# EAGLE design mag_encoder_Rev2 (EAGLE 7.4.0)
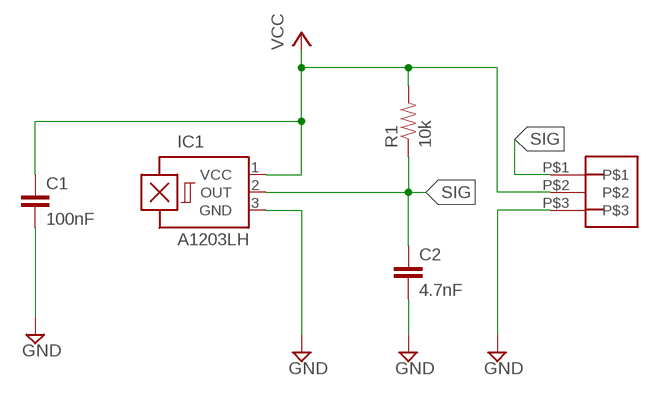
[diagram p0: schematic, sheet 1]

## Parts
C1  100nF  CAP0603-CAP  [0603-CAP]
C2  4.7nF  4.7NF-50V-10%(0603)  [0603-CAP]
IC1  A1203LH  [SOT23-W]
R1  10k  10.5KOHM1/10W1%(0603)  [0603]
U$1  3_PIN_JST-XH  [3_PIN_JST-XH]

## Nets
GND: C1.2 C2.2 IC1.3(GND) U$1.P$3
SIG: C2.1 IC1.2(OUT) R1.1 U$1.P$1
VCC: C1.1 IC1.1(VCC) R1.2 U$1.P$2

## Library data of the parts
C1 = SparkFun-Capacitors:CAP: Capacitor Standard 0603 ceramic capacitor, and 0.1" leaded capacitor.
C2 = SparkFun-Capacitors:4.7NF-50V-10%(0603): CAP-11378; PROD_ID: CAP-11378
IC1 = allegro:A12*?: Hall-effect bipolar switch Source: http://www.allegromicro.com/en/Products/Part_Numbers/1202/1202.pdf; MF: ALLEGRO MICROSYSTEMS, INC.; MPN: A1203LLHLT-T; OC_FARNELL: 1791384; OC_NEWARK: 31K6608
R1 = SparkFun-Resistors:10.5KOHM1/10W1%(0603): RES-09570; PROD_ID: RES-09570; VALUE: 10.5k
U$1 = Clayton:3_PIN_JST-XH: 3-pin JST XH Shrouded Header, top entry, 2.5 mm pitch

## Board
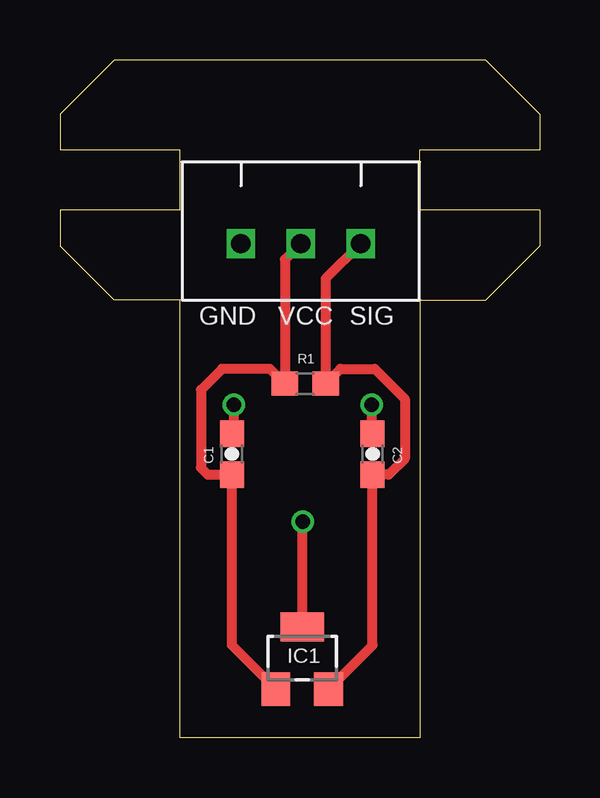
[diagram p1: board, top side]
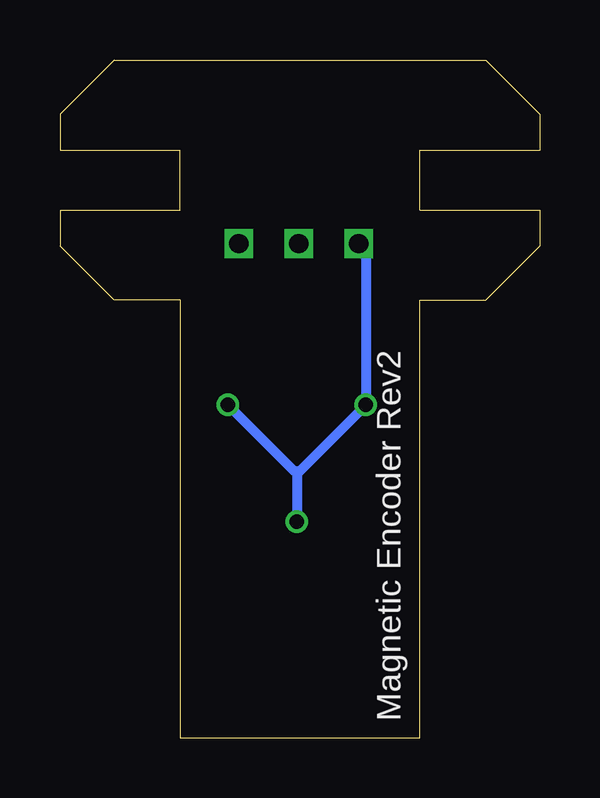
[diagram p2: board, bottom side, seen from below]

Size 20 x 28.25 mm. Coordinates in mm from the lower left corner, seen from the top.
Outline: 5,0 5,18.25 2.25,18.25 0,20.5 0,22 5,22 5,24.5 0,24.5 0,26 2.25,28.25 17.75,28.25 20,26 20,24.5 15,24.5 15,22 20,22 20,20.5 17.75,18.25 15,18.25 15,0 5,0
Copper layers (1*16): Top 0.0356mm / dielectric 1.5011mm / Bottom 0.0356mm
Design rules "LaenPCBOrder": minimum track width 6mil, minimum drill 13mil, track to track 6mil, track to pad 6mil, pad to pad 6mil, via to via 6mil, smd to smd 6mil, copper to edge 15mil, drill to drill 6mil, minimum pad ring 7mil, minimum via ring 7mil, stop-mask expansion 3mil, vias tented up to drill 0mil, thermal gap 10mil

### Footprints (pad centres in the part's own frame; a part is rotated, then mirrored left to right if it is on the bottom)
0603-CAP = smd 1.1 x 1: 1 -0.85,0; 2 0.85,0
SOT23-W = smd 1.2 x 1.4: 1 -1.1,-1.3; 2 1.1,-1.3 | smd 1.8 x 1.2: 3 0,1.3
0603 = smd 1.1 x 1: 1 -0.85,0; 2 0.85,0
3_PIN_JST-XH = drill 0.8 square: P$1 2.45,3.4; P$2 4.95,3.4; P$3 7.45,3.4

### Placement (x,y rotation side)
C1  7.17,11.81 90 top
C2  13.04,11.81 90 top
IC1  10.1,3.32 0 top
R1  10.23,14.75 180 top
U$1  14.99,24 180 top

### Tracks (layer width: path | path; a pad name or v marks a point on that pad's centre or on a via)
GND  (via drill 0.6)
  Top 0.406: C1.2 7.25,12.75 v7.25,13.88 | C2.2 13,12.7 v13,13.88 | v10.12,9 10.1,8.98 IC1.3
  Bottom 0.406: 10,11.12 v7.25,13.88 7.25,20.31 U$1.P$3 | 10,11.12 10.12,11 v10.12,9 | v13,13.88 10.25,11.12 10,11.12
SIG
  Top 0.406: U$1.P$1 11.08,19.13 R1.1 11.7,15.38 13.12,15.38 14.38,14.12 14.38,11.62 13.71,10.96 C2.1 13.04,3.85 IC1.2
VCC
  Top 0.406: U$1.P$2 9.38,19.93 R1.2 8.76,15.38 6.75,15.38 5.88,14.5 5.88,11.25 6.16,10.96 C1.1 7.17,3.85 IC1.1

### Text on the board
tNames: GND | VCC | SIG
bNames: Magnetic Encoder Rev2